# Altium schematic sheet Sheet2-USB.SchDoc
size A3; SheetNumber: 3; SheetTotal: 5
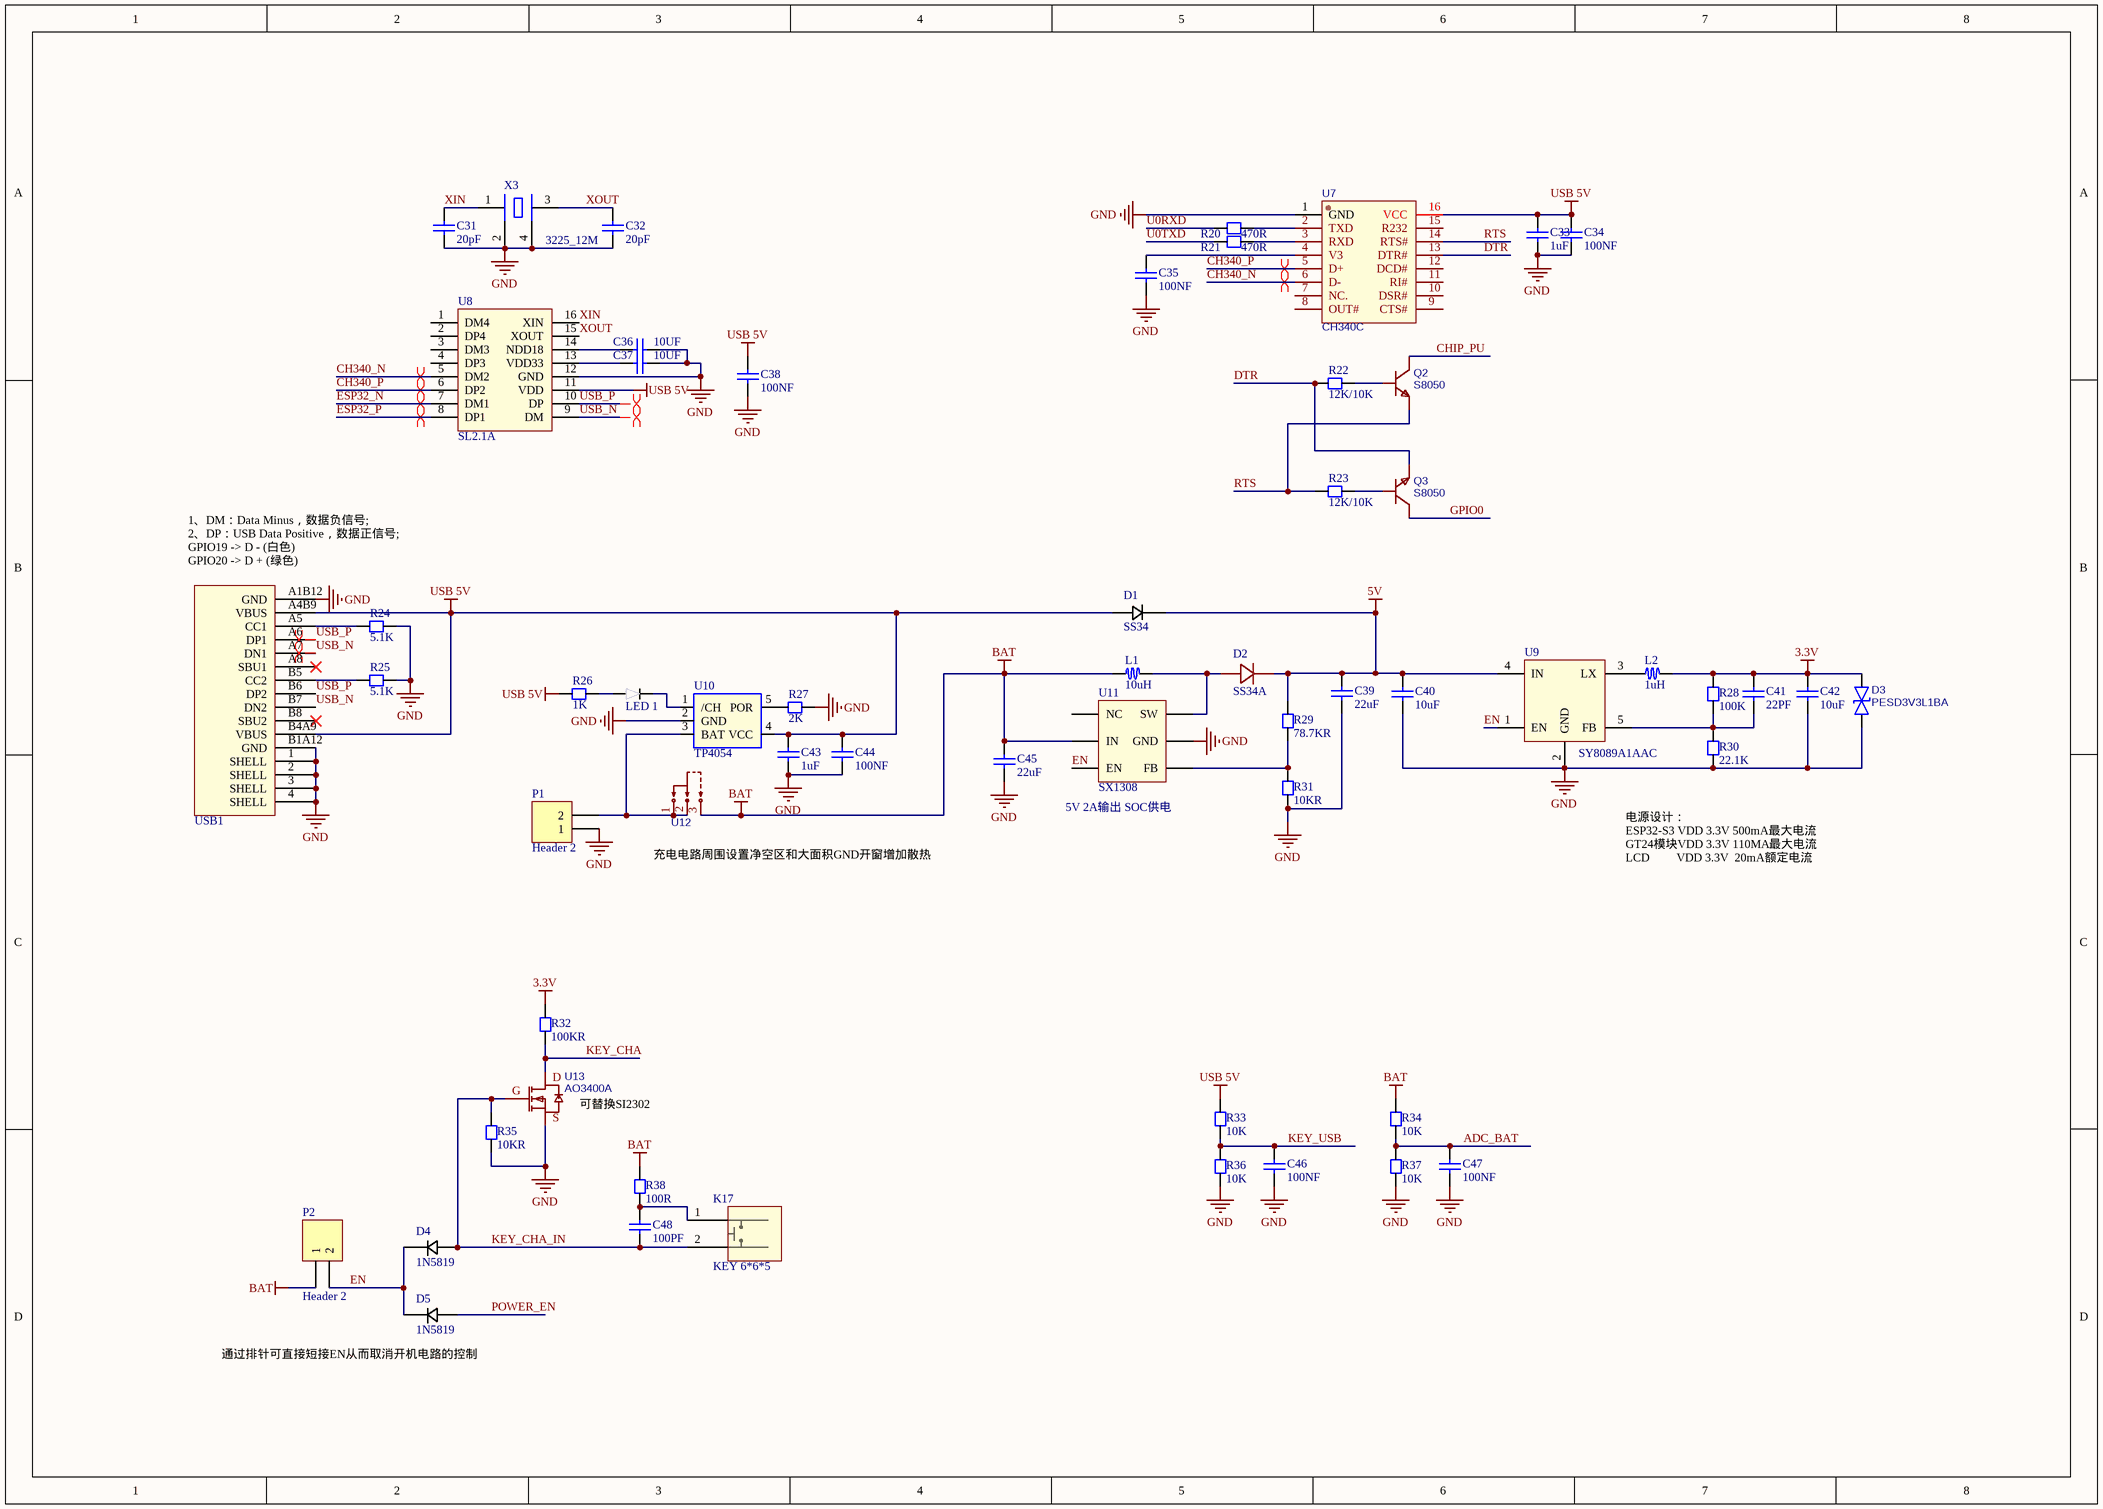
[diagram p0: Sheet2-USB.SchDoc]

## Parts
C31  20pF  [CC1608-0603]
C32  20pF  [CC1608-0603]
C33  1uF  [CC1608-0603]
C34  100NF  [CC1608-0603]
C35  100NF  [CC1608-0603]
C36  10UF  [CC1608-0603]
C37  10UF  [CC1608-0603]
C38  100NF  [CC1608-0603]
C39  22uF  [CC1608-0603]
C40  10uF  [CC1608-0603]
C41  22PF  [CC1608-0603]
C42  10uF  [CC1608-0603]
C43  1uF  [CC1608-0603]
C44  100NF  [CC1608-0603]
C45  22uF  [CC1608-0603]
C46  100NF  [CC1608-0603]
C47  100NF  [CC1608-0603]
C48  100PF  [CC1608-0603]
D1  SS34  [DO-214 AA]
D2  SS34A  [DO-214 AA SMB]
D3  PESD3V3L1BA  [SOD-323]
D4  1N5819  [SOD-323_L1.8-W1.3-LS2.5-RD]
D5  1N5819  [SOD-323_L1.8-W1.3-LS2.5-RD]
K17  KEY 6*6*5  [KEY 6*6*5]
L1  10uH  [Inductor-6045]
L2  1uH  [Inductor-4018]
LED_1  LED 0603  [LED 0603]  (value not drawn)
P1  Header 2  [HX2.54-2]
P2  Header 2  [HDR1X2]
Q2  S8050  [SOT-23]
Q3  S8050  [SOT-23]
R20  470R  [CR1608-0603]
R21  470R  [CR1608-0603]
R22  12K/10K  [CR1608-0603]
R23  12K/10K  [CR1608-0603]
R24  5.1K  [CR1608-0603]
R25  5.1K  [CR1608-0603]
R26  1K  [CR1608-0603]
R27  2K  [CR1608-0603]
R28  100K  [CR1608-0603]
R29  78.7KR  [CR1608-0603]
R30  22.1K  [CR1608-0603]
R31  10KR  [CR1608-0603]
R32  100KR  [CR1608-0603]
R33  10K  [CR1608-0603]
R34  10K  [CR1608-0603]
R35  10KR  [CR1608-0603]
R36  10K  [CR1608-0603]
R37  10K  [CR1608-0603]
R38  100R  [CR1608-0603]
U7  CH340C  [SOP-16]
U8  SL2.1A  [SOP-16]
U9  SY8089A1AAC  [SOT23-5]
U10  TP4054  [SOT23-5]
U11  SX1308  [SOT23-6]
U12  HX SS12D10G4  [SW-TH_3P-SS12D06]  (value not drawn)
U13  AO3400A  [SOT-23]
USB1  Tpye-c 16P  [TYPE-C 16P]  (value not drawn)
X3  3225_12M  [XTAL-3225]

## Nets
3.3V: C41.2 C42.2 D3.1 L2.2 R28.1 R32.2
5V: C39.1 C40.2 D1.1(K) D2.1(C) R29.2 U9.4(IN)
BAT: C45.2 L1.1 P2.1 R34.2 R38.1 U11.5(IN) U12.3
GND: C31.1 C32.1 C33.1 C34.1 C35.1 C36.1 C37.1 C38.1 C39.2 C40.1 C42.1 C43.1 C44.1 C45.1 C46.1 C47.1 D3.2 P1.1 R24.1 R25.1 R27.2 R30.2 R31.1 R35.1 R36.1 R37.1 U7.1(GND) U8.12(GND) U9.2(GND) U10.2(GND) U11.2(GND) U13.2(S) USB1.1(SHELL) USB1.2(SHELL) USB1.3(SHELL) USB1.4(SHELL) USB1.A1B12(GND) USB1.B1A12(GND) X3.2(GND) X3.4(GND)
USB 5V: C33.2 C34.2 C38.2 C43.2 C44.2 D1.2(A) R26.1 R33.2 U7.16(VCC) U8.11(VDD) U10.4(VCC) USB1.A4B9(VBUS) USB1.B4A9(VBUS)
ADC_BAT: C47.2 R34.1 R37.2
CH340_N: U7.6(D-) U8.5(DM2)
CH340_P: U7.5(D+) U8.6(DP2)
CHIP_PU: Q2.3(C)
DTR: Q3.2(E) R22.1 U7.13(DTR#)
EN: D4.1 D5.1 P2.2 U9.1(EN) U11.4(EN)
ESP32_N: U8.7(DM1)
ESP32_P: U8.8(DP1)
GPIO0: Q3.3(C)
KEY_CHA: R32.1 U13.3(D)
KEY_CHA_IN: C48.2 D4.2 K17.2 R35.2 U13.1(G)
KEY_USB: C46.2 R33.1 R36.2
POWER_EN: D5.2
RTS: Q2.2(E) R23.1 U7.14(RTS#)
U0RXD: R20.2
U0TXD: R21.2
USB_N: U8.9(DM) USB1.A7(DN1) USB1.B7(DN2)
USB_P: U8.10(DP) USB1.A6(DP1) USB1.B6(DP2)
XIN: C31.2 U8.16(XIN) X3.1(OSC1)
XOUT: C32.2 U8.15(XOUT) X3.3(OSC2)
NetC35_2: C35.2 U7.4(V3)
NetC36_2: C36.2 U8.14(NDD18)
NetC37_2: C37.2 U8.13(VDD33)
NetC41_1: C41.1 R28.2 R30.1 U9.5(FB)
NetC48_1: C48.1 K17.1 R38.2
NetD2_2: D2.2(A) L1.2 U11.1(SW)
NetL2_1: L2.1 U9.3(LX)
NetLED_1_1: LED_1.1 R26.2
NetLED_1_2: LED_1.2 U10.1(/CH)
NetP1_2: P1.2 U10.3(BAT) U12.1 U12.2
NetQ2_1: Q2.1(B) R22.2
NetQ3_1: Q3.1(B) R23.2
NetR20_1: R20.1 U7.2(TXD)
NetR21_1: R21.1 U7.3(RXD)
NetR24_2: R24.2 USB1.A5(CC1)
NetR25_2: R25.2 USB1.B5(CC2)
NetR27_1: R27.1 U10.5(POR)
NetR29_1: R29.1 R31.2 U11.3(FB)

Not connected (* = marked no-connect by the designer): U7 7(NC.) 8(OUT#) 9(CTS#) 10(DSR#) 11(RI#) 12(DCD#) 15(R232); U8 1(DM4) 2(DP4) 3(DM3) 4(DP3); U11 6(NC); USB1 A8(SBU1)* B8(SBU2)*

## Layout directives
differential pair: CH340_N, CH340_P, ESP32_N, ESP32_P, USB_N, USB_P

## Notes on the sheet
- (near USB1) 1、DM：Data Minus，数据负信号;
  2、DP：USB Data Positive，数据正信号;
  GPIO19 -> D - (白色)
  GPIO20 -> D + (绿色)
- (near U12) 充电电路周围设置净空区和大面积GND开窗增加散热
- (near U11) 5V 2A输出 SOC供电
- 电源设计：
  ESP32-S3 VDD 3.3V 500mA最大电流
  GT24模块VDD 3.3V 110MA最大电流
  LCD         VDD 3.3V  20mA额定电流
- (near U13) 可替换SI2302
- 通过排针可直接短接EN从而取消开机电路的控制

## Library data of the parts
C31-C38 C40-C48 = Cap Chip 0603: 0603封装的电容; Published: 8-Jun-2000; Revision: July-2002: Re-released for DXP Platform.; Publisher: Altium Limited
C39 = Chip capacitor: 贴片电容
D1 = SS34: 肖特基二极管
D2 = SS34A: 大电流肖特基二极管，5A/40V
D3 = PESD3V3L1BA: SOD-323 3.3V 双向ESD防静电二极管保护芯片; Manufacturer: MDD; Manufacturer Part: SMAJ6.5CA; Supplier: LCSC; Supplier Part: C110041; JLCPCB Part Class: Extended Part; spicePre: D; spiceSymbolName: SMAJ6.5CA-C110041
D4 D5 = 1N5819: 肖特基二极管
K17 = KEY 6*6*5: 无声轻触开关
L1 = Inductor-6045: 6045封装 线绕SMD功率电感
L2 = Inductor-4018: 贴片电感 1206封装
P1 P2 = Header 2: Header, 2-Pin; LatestRevisionDate: 17-Jul-2002; LatestRevisionNote: Re-released for DXP Platform.; Publisher: Altium Limited
Q2 Q3 = S8050: Manufacturer: SALLTECH(萨瑞); Contributor: lcsc; Supplier: LCSC; Supplier Part: C3027096; Manufacturer Part: S8050; spicePre: Q; spiceSymbolName: S8050_C3027096
R20-R28 R30 R33 R34 R36-R38 = Resistor Chip 0603: 0603封装电阻; Published: 8-Jun-2000; Revision: July-2002: Re-released for DXP Platform.; Publisher: Altium Limited
R29 R31 R32 R35 = Chip resistor: 贴片电阻
U7 = CH340C: Manufacturer: WCH(南京沁恒); Supplier: LCSC; Manufacturer Part: CH340C; Supplier Part: C84681; JLCPCB Part Class: Extended Part; spicePre: U; spiceSymbolName: CH340C
U8 = SL2.1A: USB HUB 四拓展
U9 = SY8089A1AAC: SY8089A1是一种高效率的1.5MHz同步降压DC/DC稳压器，能够提供高达输出电流2A。它可以在2.5V到5.5V的宽输入电压范围内工作，集成了主开关和同步开关，具有极低的RDS(ON)，最大限度地减少了导通损耗。 / 输出电压纹波小，外接电感小，电容器尺寸小 / 1.5MHz开关频率。
U10 = TP4054: 迷你充电IC SOT-23-5
U11 = SX1308: SOT23-6 升压芯片
U12 = SW-TH_3P-SS12D06: BOM_Manufacturer: hanxia(韩下); Contributor: lcsc; BOM_Supplier: LCSC; BOM_Supplier Part: C5149841; BOM_Manufacturer Part: HX SS12D10G4; link: https://atta.szlcsc.com/upload/public/pdf/source/20220907/2020D7183ED16DD6E2B9F5A13FB144CF.pdf; BOM_JLCPCB Part Class: Extended Part; spicePre: U; spiceSymbolName: HX SS12D10G4
U13 = AO3400A: UMW AO3400A SOT-23 30V/5.8A N沟道 MOS(场效应管)芯片; Manufacturer: ElecSuper(静芯微）; Manufacturer Part: AO3401A; Contributor: lcsc; Supplier: LCSC; Supplier Part: C5224202; JLCPCB Part Class: Extended Part; link: https://so.szlcsc.com/global.html?k=C5224202&ref=editor; spicePre: U; spiceSymbolName: AO3401A_C5224202
USB1 = Tpye-c 16P: 16P 封装的TYPE -c接口 4固定插脚 双向
X3 = XTAL 3225: 3225封装的晶振